# Altium schematic sheet Superseal.SchDoc
size A
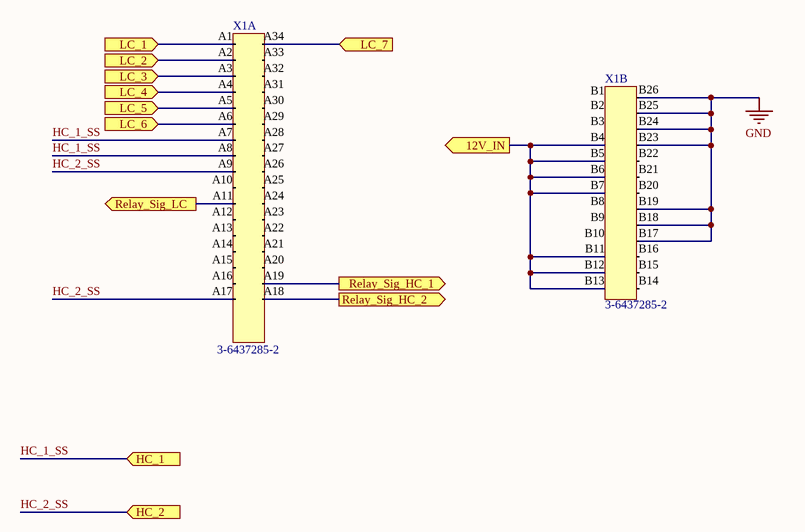
[diagram p0: Superseal.SchDoc]

## Parts
X1  3-6437285-2  [SUPERSEAL 60POS 90Deg]  (parts A,B of 2)

## Ports
12V_IN (out), HC_1 (in), HC_2 (in), LC_1 (in), LC_2 (in), LC_3 (in), LC_4 (in), LC_5 (in), LC_6 (in), LC_7 (in), Relay_Sig_HC_1 (out), Relay_Sig_HC_2 (out), Relay_Sig_LC (out)

## Nets
GND: X1.B17 X1.B18 X1.B19 X1.B23 X1.B24 X1.B25 X1.B26
12V_IN: X1.B4 X1.B5 X1.B6 X1.B7 X1.B11 X1.B12 X1.B13 ; port 12V_IN
HC_1_SS: X1.A7 X1.A8 ; port HC_1
HC_2_SS: X1.A9 X1.A17 ; port HC_2
LC_1: X1.A1 ; port LC_1
LC_2: X1.A2 ; port LC_2
LC_3: X1.A3 ; port LC_3
LC_4: X1.A4 ; port LC_4
LC_5: X1.A5 ; port LC_5
LC_6: X1.A6 ; port LC_6
LC_7: X1.A34 ; port LC_7
Relay_Sig_HC_1: X1.A19 ; port Relay_Sig_HC_1
Relay_Sig_HC_2: X1.A18 ; port Relay_Sig_HC_2
Relay_Sig_LC: X1.A11 ; port Relay_Sig_LC

Not connected (* = marked no-connect by the designer): X1 A10 A12 A13 A14 A15 A16 A20 A21 A22 A23 A24 A25 A26 A27 A28 A29 A30 A31 A32 A33 B1 B2 B3 B8 B9 B10 B14 B15 B16 B20 B21 B22

## Library data of the parts
X1 = 3: 90 Degree; Manufacturer_id: 1; idConn: 3; Name: AMP Superseal 60POS 90Deg; Value: CONN; Num_Contacts: 60; Num_Rows: 4; Pitch: 3 mm; MfrPartNo: 3-6437285-2; Drawer_id: 1; Link: https://www.te.com/usa-en/product-3-6437285-2.html; ComponentLink1Description: Datasheet